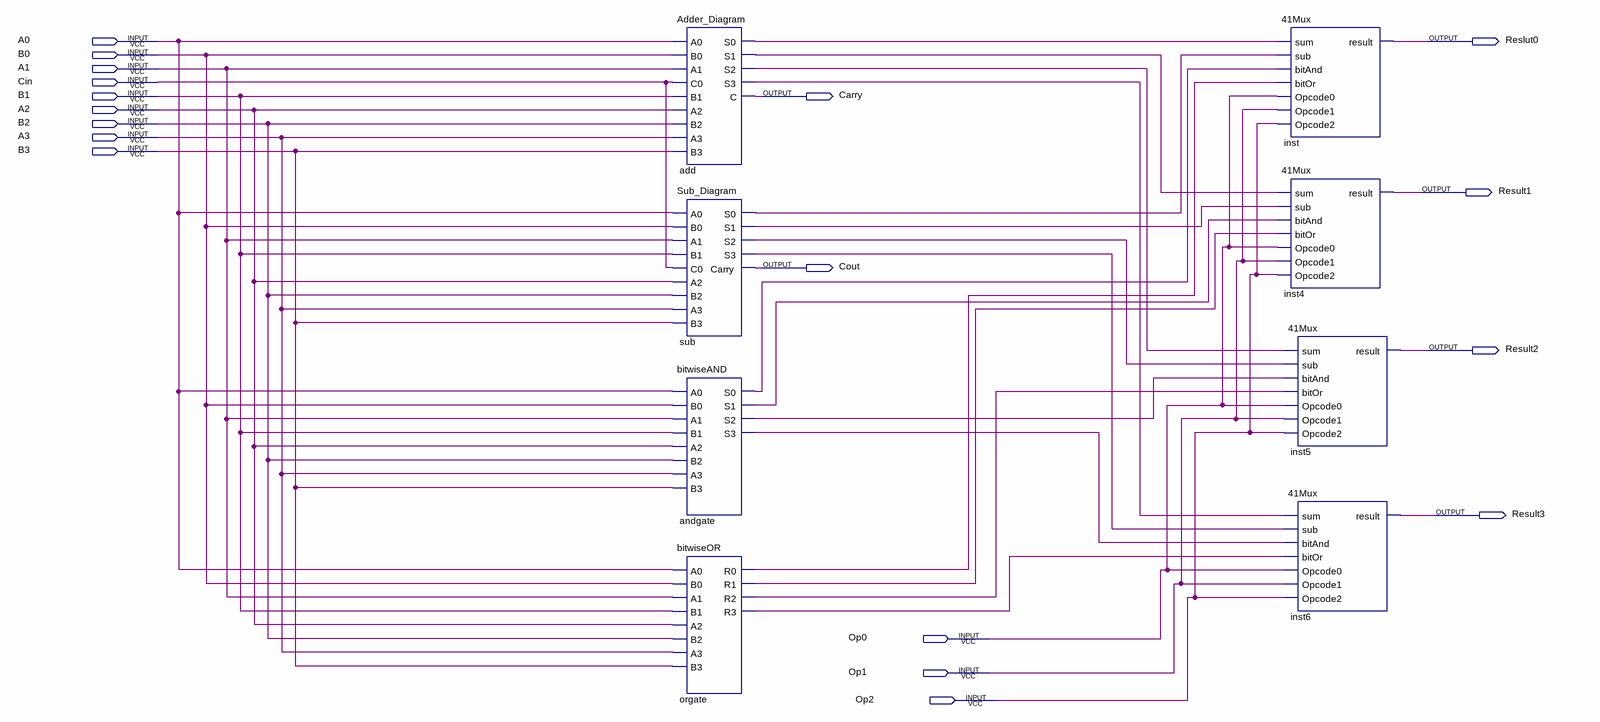
[diagram p0: schematic sheet]
// Quartus schematic ALU_Diagram.bdf as structural Verilog: 8 symbols, 18 pins
module ALU_Diagram (
  input  A0,
  input  B0,
  input  A1,
  input  Cin,
  input  B1,
  input  A2,
  input  B2,
  input  A3,
  input  B3,
  input  Op0,
  input  Op1,
  input  Op2,
  output Reslut0,
  output Carry,
  output Result1,
  output Cout,
  output Result2,
  output Result3
);

  wire add_s0, add_s1, add_s2, add_s3, andgate_s0, andgate_s1, andgate_s2, andgate_s3, orgate_r0, orgate_r1,
       orgate_r2, orgate_r3, sub_s0, sub_s1, sub_s2, sub_s3;

  Adder_Diagram add (
    .A0(A0), .B0(B0), .A1(A1), .C0(Cin), .B1(B1), .A2(A2), .B2(B2), .A3(A3), .B3(B3), .S0(add_s0),
    .S1(add_s1), .S2(add_s2), .S3(add_s3), .C(Carry));
  Sub_Diagram sub (
    .A0(A0), .B0(B0), .A1(A1), .B1(B1), .C0(Cin), .A2(A2), .B2(B2), .A3(A3), .B3(B3), .S0(sub_s0),
    .S1(sub_s1), .S2(sub_s2), .S3(sub_s3), .Carry(Cout));
  bitwiseAND andgate (
    .A0(A0), .B0(B0), .A1(A1), .B1(B1), .A2(A2), .B2(B2), .A3(A3), .B3(B3), .S0(andgate_s0), .S1(andgate_s1),
    .S2(andgate_s2), .S3(andgate_s3));
  bitwiseOR orgate (
    .A0(A0), .B0(B0), .A1(A1), .B1(B1), .A2(A2), .B2(B2), .A3(A3), .B3(B3), .R0(orgate_r0), .R1(orgate_r1),
    .R2(orgate_r2), .R3(orgate_r3));
  \41Mux  inst (
    .sum(add_s0), .sub(sub_s0), .bitAnd(andgate_s0), .bitOr(orgate_r0), .Opcode0(Op0), .Opcode1(Op1),
    .Opcode2(Op2), .result(Reslut0));
  \41Mux  inst4 (
    .sum(add_s1), .sub(sub_s1), .bitAnd(andgate_s1), .bitOr(orgate_r1), .Opcode0(Op0), .Opcode1(Op1),
    .Opcode2(Op2), .result(Result1));
  \41Mux  inst5 (
    .sum(add_s2), .sub(sub_s2), .bitAnd(andgate_s2), .bitOr(orgate_r2), .Opcode0(Op0), .Opcode1(Op1),
    .Opcode2(Op2), .result(Result2));
  \41Mux  inst6 (
    .sum(add_s3), .sub(sub_s3), .bitAnd(andgate_s3), .bitOr(orgate_r3), .Opcode0(Op0), .Opcode1(Op1),
    .Opcode2(Op2), .result(Result3));
endmodule
